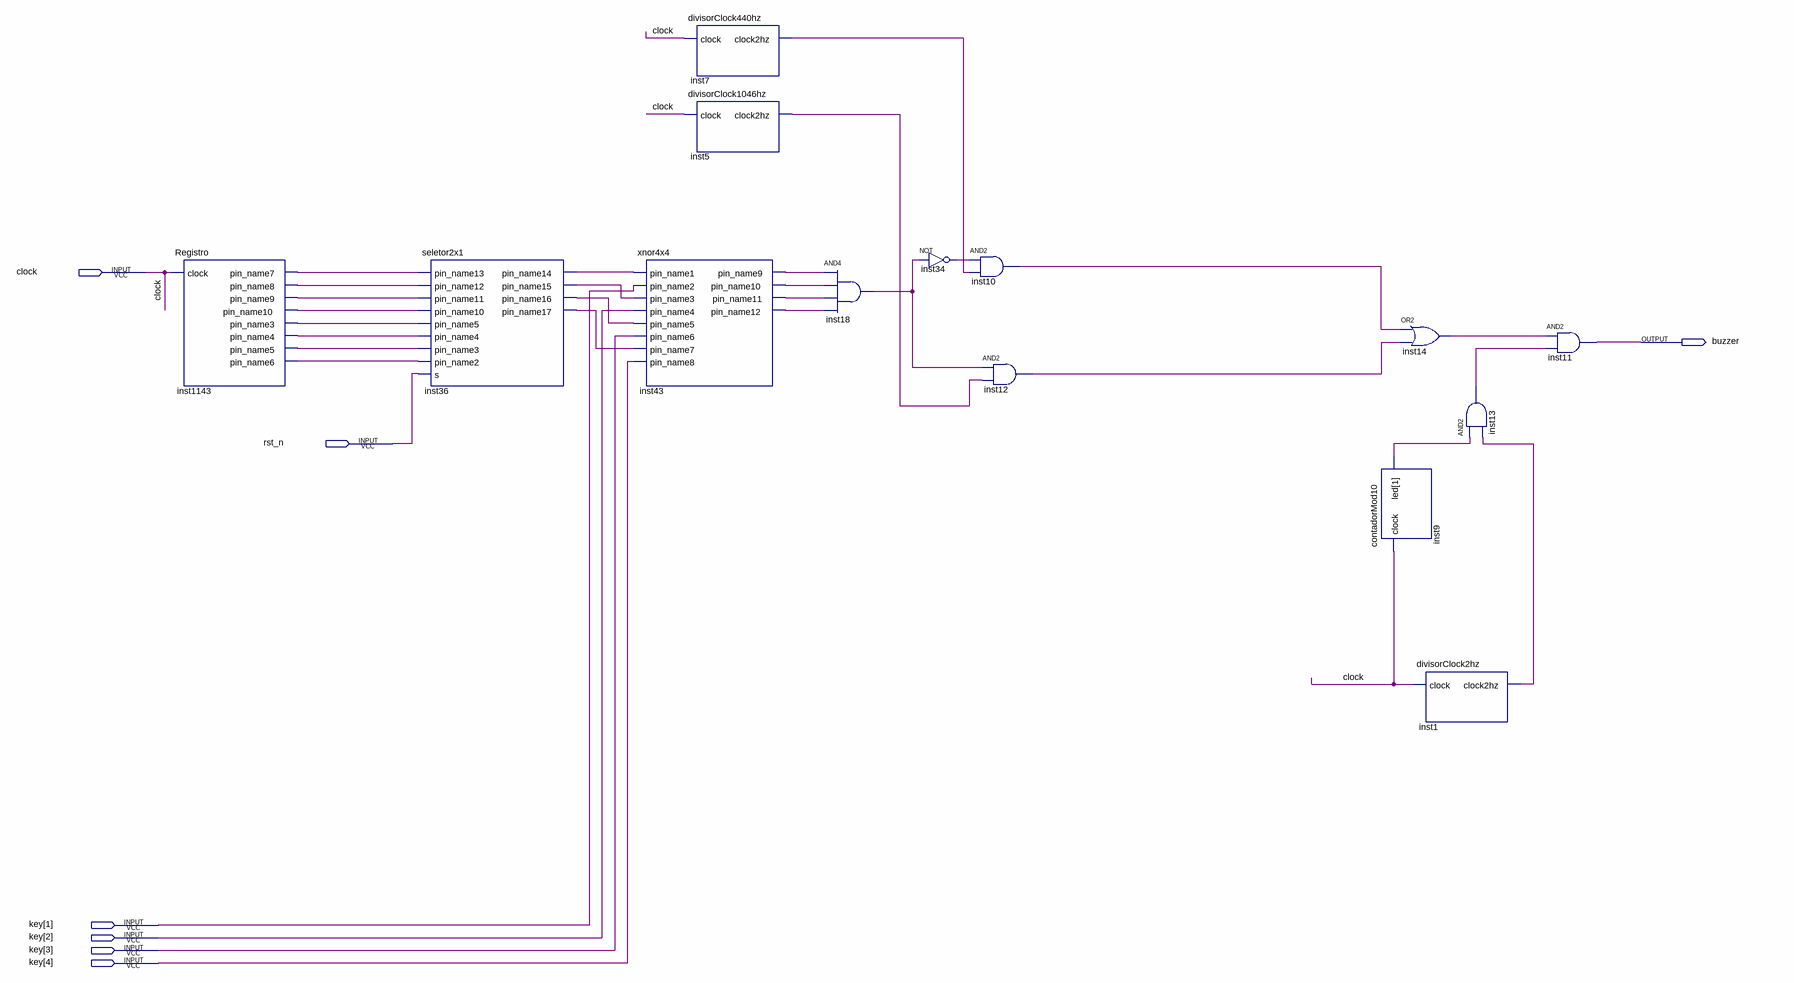
[diagram p0: schematic sheet]
// Quartus schematic teste_comparador.bdf as structural Verilog: 14 symbols, 7 pins
module teste_comparador (
  input  clock,
  input  rst_n,
  input  [4:1] key,
  output buzzer
);

  wire inst1_clock2hz, inst5_clock2hz, inst7_clock2hz, inst9_led, inst10_out, inst12_out, inst13_out,
       inst14_out, inst18_out, inst34_out, inst36_pin_name14, inst36_pin_name15, inst36_pin_name16,
       inst36_pin_name17, inst43_pin_name9, inst43_pin_name10, inst43_pin_name11, inst43_pin_name12,
       inst1143_pin_name3, inst1143_pin_name4, inst1143_pin_name5, inst1143_pin_name6, inst1143_pin_name7,
       inst1143_pin_name8, inst1143_pin_name9, inst1143_pin_name10;

  Registro inst1143 (
    .clock(clock), .pin_name7(inst1143_pin_name7), .pin_name8(inst1143_pin_name8),
    .pin_name9(inst1143_pin_name9), .pin_name10(inst1143_pin_name10), .pin_name3(inst1143_pin_name3),
    .pin_name4(inst1143_pin_name4), .pin_name5(inst1143_pin_name5), .pin_name6(inst1143_pin_name6));
  seletor2x1 inst36 (
    .pin_name13(inst1143_pin_name7), .pin_name12(inst1143_pin_name8), .pin_name11(inst1143_pin_name9),
    .pin_name10(inst1143_pin_name10), .pin_name5(inst1143_pin_name3), .pin_name4(inst1143_pin_name4),
    .pin_name3(inst1143_pin_name5), .pin_name2(inst1143_pin_name6), .s(rst_n),
    .pin_name14(inst36_pin_name14), .pin_name15(inst36_pin_name15), .pin_name16(inst36_pin_name16),
    .pin_name17(inst36_pin_name17));
  xnor4x4 inst43 (
    .pin_name1(inst36_pin_name14), .pin_name2(key[1]), .pin_name3(inst36_pin_name15), .pin_name4(key[2]),
    .pin_name5(inst36_pin_name16), .pin_name6(key[3]), .pin_name7(inst36_pin_name17), .pin_name8(key[4]),
    .pin_name9(inst43_pin_name9), .pin_name10(inst43_pin_name10), .pin_name11(inst43_pin_name11),
    .pin_name12(inst43_pin_name12));
  divisorClock440hz inst7 (.clock(clock), .clock2hz(inst7_clock2hz));
  divisorClock1046hz inst5 (.clock(clock), .clock2hz(inst5_clock2hz));
  and inst18 (inst18_out, inst43_pin_name9, inst43_pin_name10, inst43_pin_name11, inst43_pin_name12);
  not inst34 (inst34_out, inst18_out);
  and inst10 (inst10_out, inst34_out, inst7_clock2hz);
  and inst12 (inst12_out, inst18_out, inst5_clock2hz);
  contadorMod10 inst9 (.clock(clock), .led(inst9_led));
  or inst14 (inst14_out, inst10_out, inst12_out);
  divisorClock2hz inst1 (.clock(clock), .clock2hz(inst1_clock2hz));
  and inst13 (inst13_out, inst9_led, inst1_clock2hz);
  and inst11 (buzzer, inst14_out, inst13_out);
endmodule
